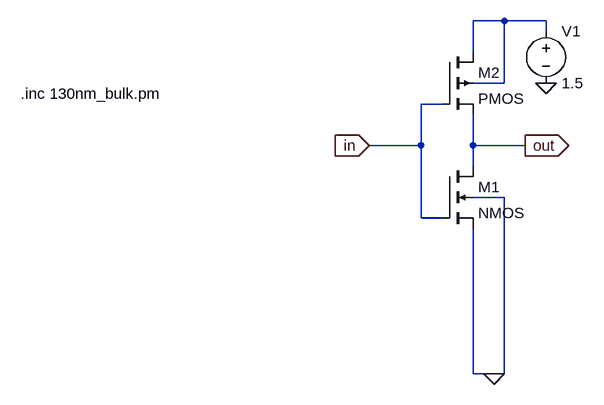
[diagram p0: schematic invert.asc]
invert.asc, the LTspice schematic file:
Version 4
SHEET 1 1184 680
WIRE 240 -80 192 -80
WIRE 304 -80 240 -80
WIRE 304 -64 304 -80
WIRE 192 -32 192 -80
WIRE 240 16 240 -80
WIRE 240 16 192 16
WIRE 144 48 112 48
WIRE 112 112 112 48
WIRE 112 112 32 112
WIRE 192 112 192 64
WIRE 272 112 192 112
WIRE 192 144 192 112
WIRE 240 192 192 192
WIRE 112 224 112 112
WIRE 144 224 112 224
WIRE 192 464 192 240
WIRE 224 464 192 464
WIRE 240 464 240 192
WIRE 240 464 224 464
FLAG 32 112 in
IOPIN 32 112 In
FLAG 272 112 out
IOPIN 272 112 Out
FLAG 224 464 0
FLAG 304 16 0
SYMBOL nmos4 144 144 R0
SYMATTR InstName M1
SYMATTR Value2 l=130e-9 w=1300e-9 ad=676000e-18 as=676000e-18 pd=3640e-9 ps=3640e-9
SYMBOL pmos4 144 -32 R0
SYMATTR InstName M2
SYMATTR Value2 l=130e-9 w=260e-9 ad=676000e-18 as=676000e-18 pd=3640e-9 ps=3640e-9
SYMBOL voltage 304 -80 R0
WINDOW 123 0 0 Left 0
WINDOW 39 0 0 Left 0
SYMATTR InstName V1
SYMATTR Value 1.5
TEXT -504 32 Left 2 !.inc 130nm_bulk.pm

The netlist it stands for:
* invert.asc
M1 out in 0 0 NMOS l=130e-9 w=1300e-9 ad=676000e-18 as=676000e-18 pd=3640e-9 ps=3640e-9
M2 N001 in out N001 PMOS l=130e-9 w=260e-9 ad=676000e-18 as=676000e-18 pd=3640e-9 ps=3640e-9
V1 N001 0 1.5
.model NMOS NMOS
.model PMOS PMOS
.lib standard.mos
.inc 130nm_bulk.pm
.backanno
.end